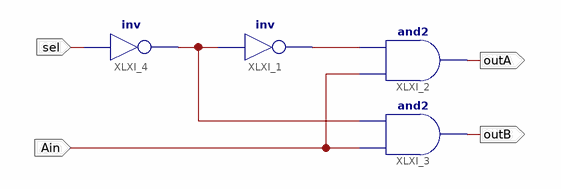
[diagram p0: schematic sheet 1]
// Xilinx ISE schematic OldOneBitDemux.sch (spartan3e) as structural Verilog: 4 symbols, 4 ports
module OldOneBitDemux (
  input  Ain,
  input  sel,
  output outA,
  output outB
);

  wire XLXN_1, XLXN_2;

  not XLXI_1 (XLXN_1, XLXN_2);
  and XLXI_2 (outA, Ain, XLXN_1);
  and XLXI_3 (outB, Ain, XLXN_2);
  not XLXI_4 (XLXN_2, sel);
endmodule
